# EAGLE design mini_arm2_brd (EAGLE 4.13)
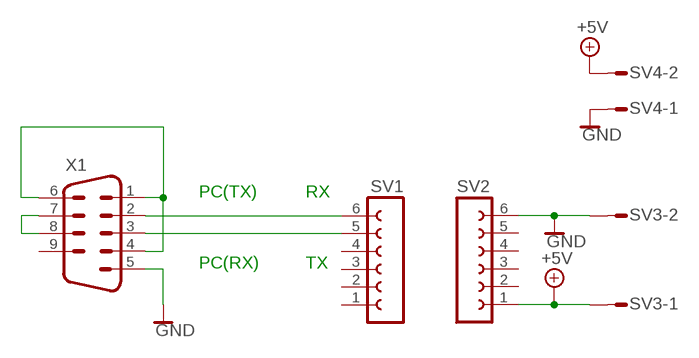
[diagram p0: schematic, sheet 1]

## Parts
SV1  FE06-1  [FE06]
SV2  FE06-1  [FE06]
SV3  L02P  [L02P]
SV4  L02P  [L02P]
X1  M09HP  [M09HP]

## Nets
0V: SV2.6 SV3.2 SV4.1 X1.5 ; supply symbol labelled GND
+5V: SV2.1 SV3.1 SV4.2
N$1: SV1.6 X1.2
N$2: SV1.5 X1.3
N$3: X1.1 X1.4 X1.6
N$4: X1.7 X1.8
Unconnected: SV1.1 SV1.2 SV1.3 SV1.4 SV2.2 SV2.3 SV2.4 SV2.5 X1.9

## Notes on the sheet
- PC(TX) | RX
- PC(RX) | TX

## Library data of the parts
SV1 SV2 = con-lsta:FE06-1: FEMALE HEADER
SV3 SV4 = con-amp-mt:L02P: AMP MT CONNECTOR
X1 = con-subd:M09: SUB-D

## Board
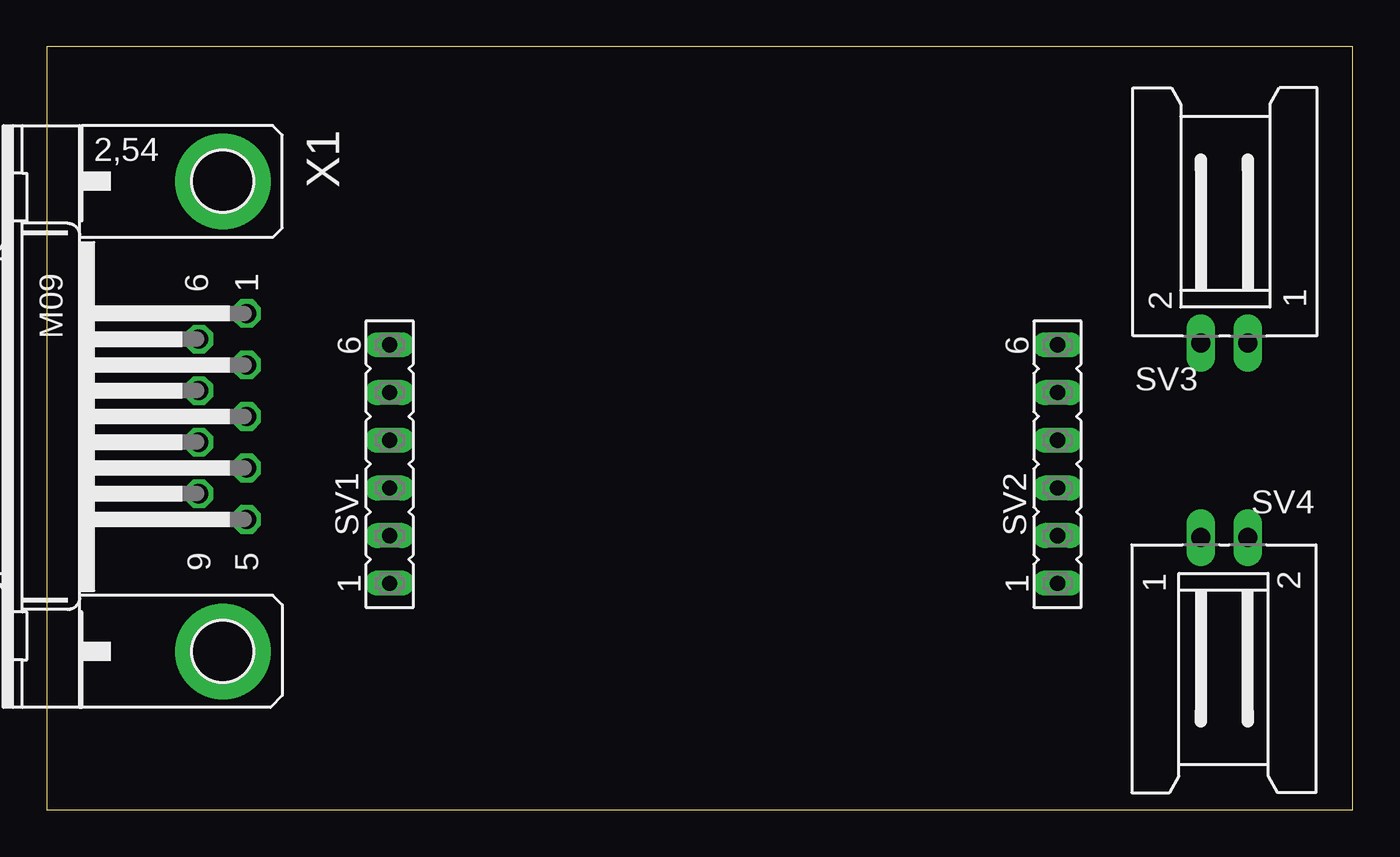
[diagram p1: board, top side]
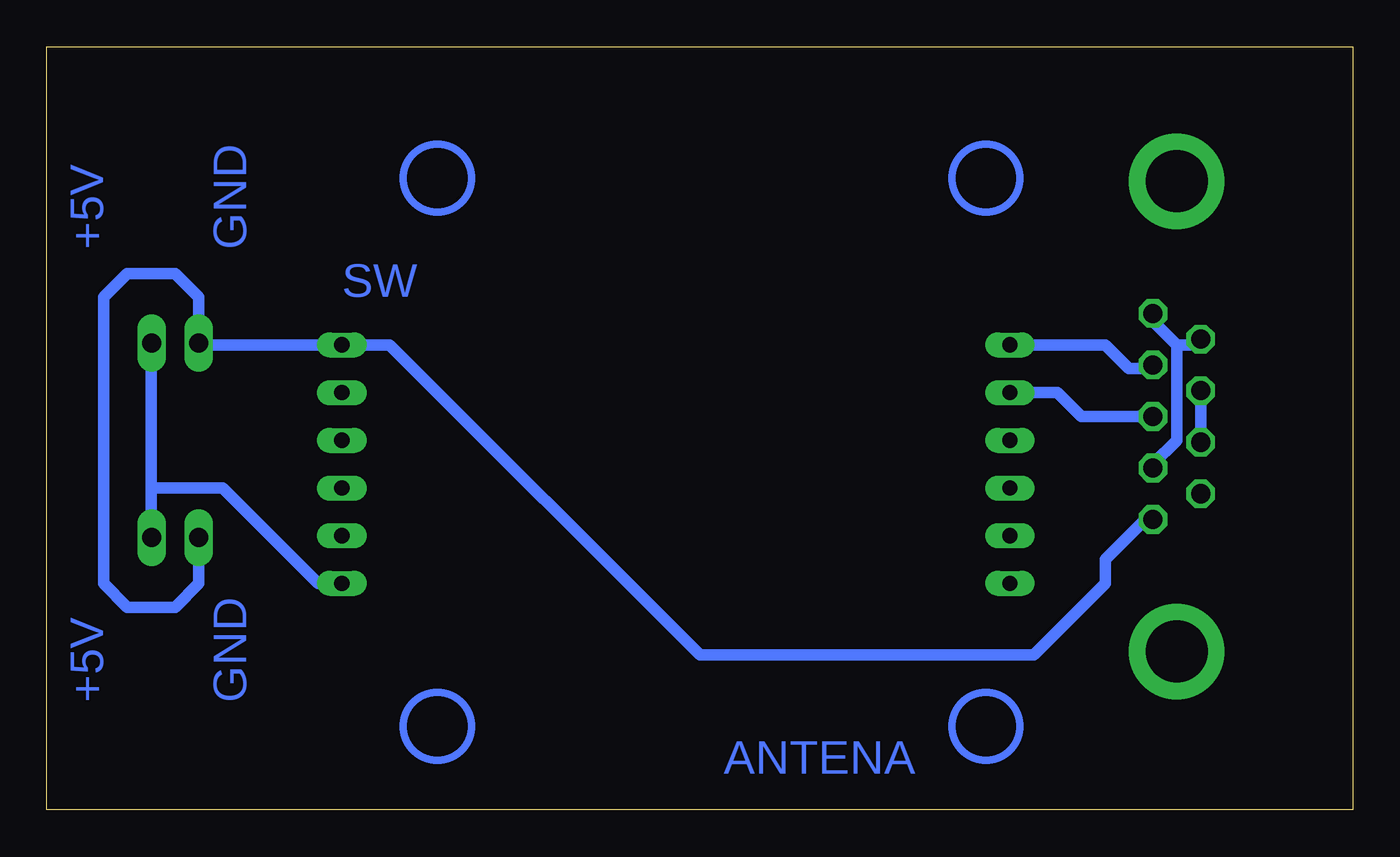
[diagram p2: board, bottom side, seen from below]

Size 69.52 x 40.63 mm. Coordinates in mm from the lower left corner, seen from the top.
Outline: 0,0 69.52,0 69.52,40.63 0,40.63 0,0
Copper layers (1*16): Top 0.035mm / dielectric 1.5mm / Bottom 0.035mm
Design rules "default": minimum track width 10mil, minimum drill 24mil, track to track 8mil, track to pad 8mil, pad to pad 8mil, via to via 8mil, smd to smd 8mil, copper to edge 40mil, drill to drill 8mil, minimum pad ring 10mil, minimum via ring 8mil, stop-mask expansion 4mil, vias tented up to drill 0mil, thermal gap 10mil

### Footprints (pad centres in the part's own frame; a part is rotated, then mirrored left to right if it is on the bottom)
FE06 = drill 0.813 long: 1 -6.35,0; 2 -3.81,0; 3 -1.27,0; 4 1.27,0; 5 3.81,0; 6 6.35,0
L02P = drill 1.016 long: 1 1.25,-6.25; 2 -1.25,-6.25
M09HP = drill 1.016 octagon: 1 -5.486,1.27; 2 -2.743,1.27; 3 0,1.27; 4 2.743,1.27; 5 5.486,1.27; 6 -4.115,-1.27; 7 -1.372,-1.27; 8 1.372,-1.27; 9 4.115,-1.27 | drill 3.302 pad 5.08 round: G1 -12.522,0; G2 12.522,0

### Placement (x,y rotation side)
SV1  18.25,18.41 90 top
SV2  53.81,18.41 90 top
SV3  62.7,31.11 0 top
SV4  62.7,8.25 180 top
X1  9.36,20.95 270 top

### Tracks (layer width: path | path; a pad name or v marks a point on that pad's centre or on a via)
0V
  Bottom 0.254: SV3.2 61.43,24.76 | X1.5 10.63,15.87
  Bottom 0.406: 61.43,24.86 SV3.2 | 61.43,14.5 SV4.1
  Bottom 0.61: 61.43,24.76 SV2.6 51.27,24.76 34.76,8.25 16.98,8.25 13.17,12.06 13.17,13.33 10.63,15.87 | 61.43,24.86 61.43,27.3 62.7,28.57 65.24,28.57 66.51,27.3 66.51,12.06 65.24,10.79 62.7,10.79 61.43,12.06 61.43,14.5 61.43,14.6
+5V
  Bottom 0.254: 63.97,17.14 63.97,15.87 SV4.2
  Bottom 0.406: SV4.2 63.97,14.5
  Bottom 0.61: 63.97,17.14 63.97,23.49 SV3.1 | 63.97,14.5 63.97,17.14 | 63.97,17.14 60.16,17.14 55.08,12.06 SV2.1
N$1
  Bottom 0.61: SV1.6 13.17,24.76 11.9,23.49 10.63,23.49 X1.2
N$2
  Bottom 0.61: X1.3 14.44,20.95 15.71,22.22 SV1.5
N$3
  Bottom 0.254: X1.4 10.63,18.41 | 10.63,26.03 X1.1
  Bottom 0.61: 10.63,18.41 9.36,19.68 9.36,24.76 | 9.36,24.76 8.09,24.76 X1.6 | 9.36,24.76 10.63,26.03
N$4
  Bottom 0.61: X1.8 X1.7
(copper drawn outside any net)
  shapes: Bottom circle x4

### Text on the board
Bottom: GND | +5V | SW | GND | +5V | ANTENA